# EAGLE schematic untitled (EAGLE 9.6.1)
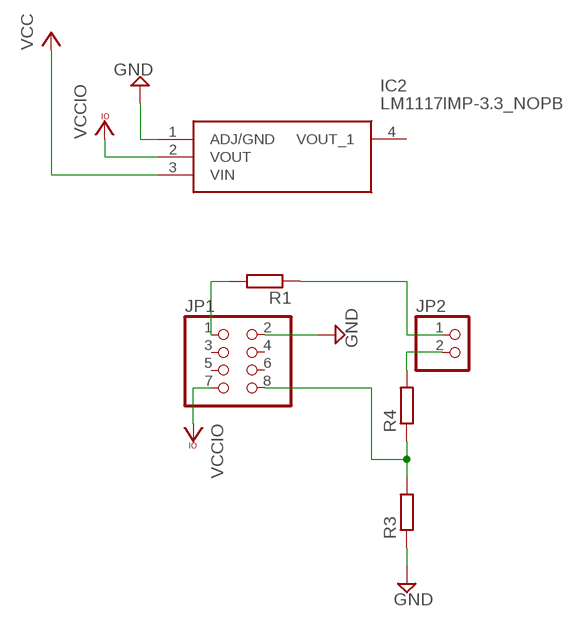
[diagram p0: schematic, sheet 1]

## Parts
IC2  LM1117IMP-3.3_NOPB  [SOT230P700X180-4N]
JP1  PINHD-2X4  [2X04]
JP2  PINHD-1X2  [1X02]
R1  R-EU_M0805  [M0805]
R3  R-EU_M0805  [M0805]
R4  R-EU_M0805  [M0805]

## Nets
GND: IC2.1(ADJ/GND) JP1.2 R3.1
N$1: JP2.1 R1.1
N$2: JP1.8 R3.2 R4.1
N$4: JP1.1 R1.2
N$9: JP2.2 R4.2
VCC: IC2.3(VIN)
VCCIO: IC2.2(VOUT) JP1.7
Unconnected: IC2.4(VOUT_1) JP1.3 JP1.4 JP1.5 JP1.6

## Library data of the parts
IC2 = SamacSys_Parts:LM1117IMP-3.3_NOPB: LM1117IMP-3.3/NOPB, Low Dropout Voltage Regulator, 1.5A, 3.3 V +/-1%, 4-Pin SOT-223 Source: Datasheet <http://docs-emea.rs-online.com/webdocs/05bb/0900766b805bb323.pdf>; DESCRIPTION: LM1117IMP-3.3/NOPB, Low Dropout Voltage Regulator, 1.5A, 3.3 V +/-1%, 4-Pin SOT-223; HEIGHT: 1.8mm; MANUFACTURER_NAME: Texas Instruments; MANUFACTURER_PART_NUMBER: LM1117IMP-3.3/NOPB; MOUSER_PART_NUMBER: 926-LM1117IMP3.3NOPB; MOUSER_PRICE-STOCK: https://www.mouser.com/Search/Refine.aspx?Keyword=926-LM1117IMP3.3NOPB; RS_PART_NUMBER: 1977198; RS_PRICE-STOCK: http://uk.rs-online.com/web/p/products/1977198
JP1 = pinhead:PINHD-2X4: PIN HEADER
JP2 = pinhead:PINHD-1X2: PIN HEADER
R1 R3 R4 = resistor:R-EU_: RESISTOR, European symbol